# Altium schematic sheet MGMEZZ02.SchDoc: Top Level
size Letter; Author: Adam Gilbert; CompanyName: McGill University; DrawnBy: Adam Gilbert; Organization: Altium Limited; Address1: McGill Cosmology; Address2: 3600 University Street; Address3: Montreal, Quebec; Address4: Canada; Revision: Rev0; ProjectTitle: Dan DfMux Mezz; ModelNumber: MGMEZZ02; DocumentName: Top Level; ProjectName: Dan DfMux Mezz
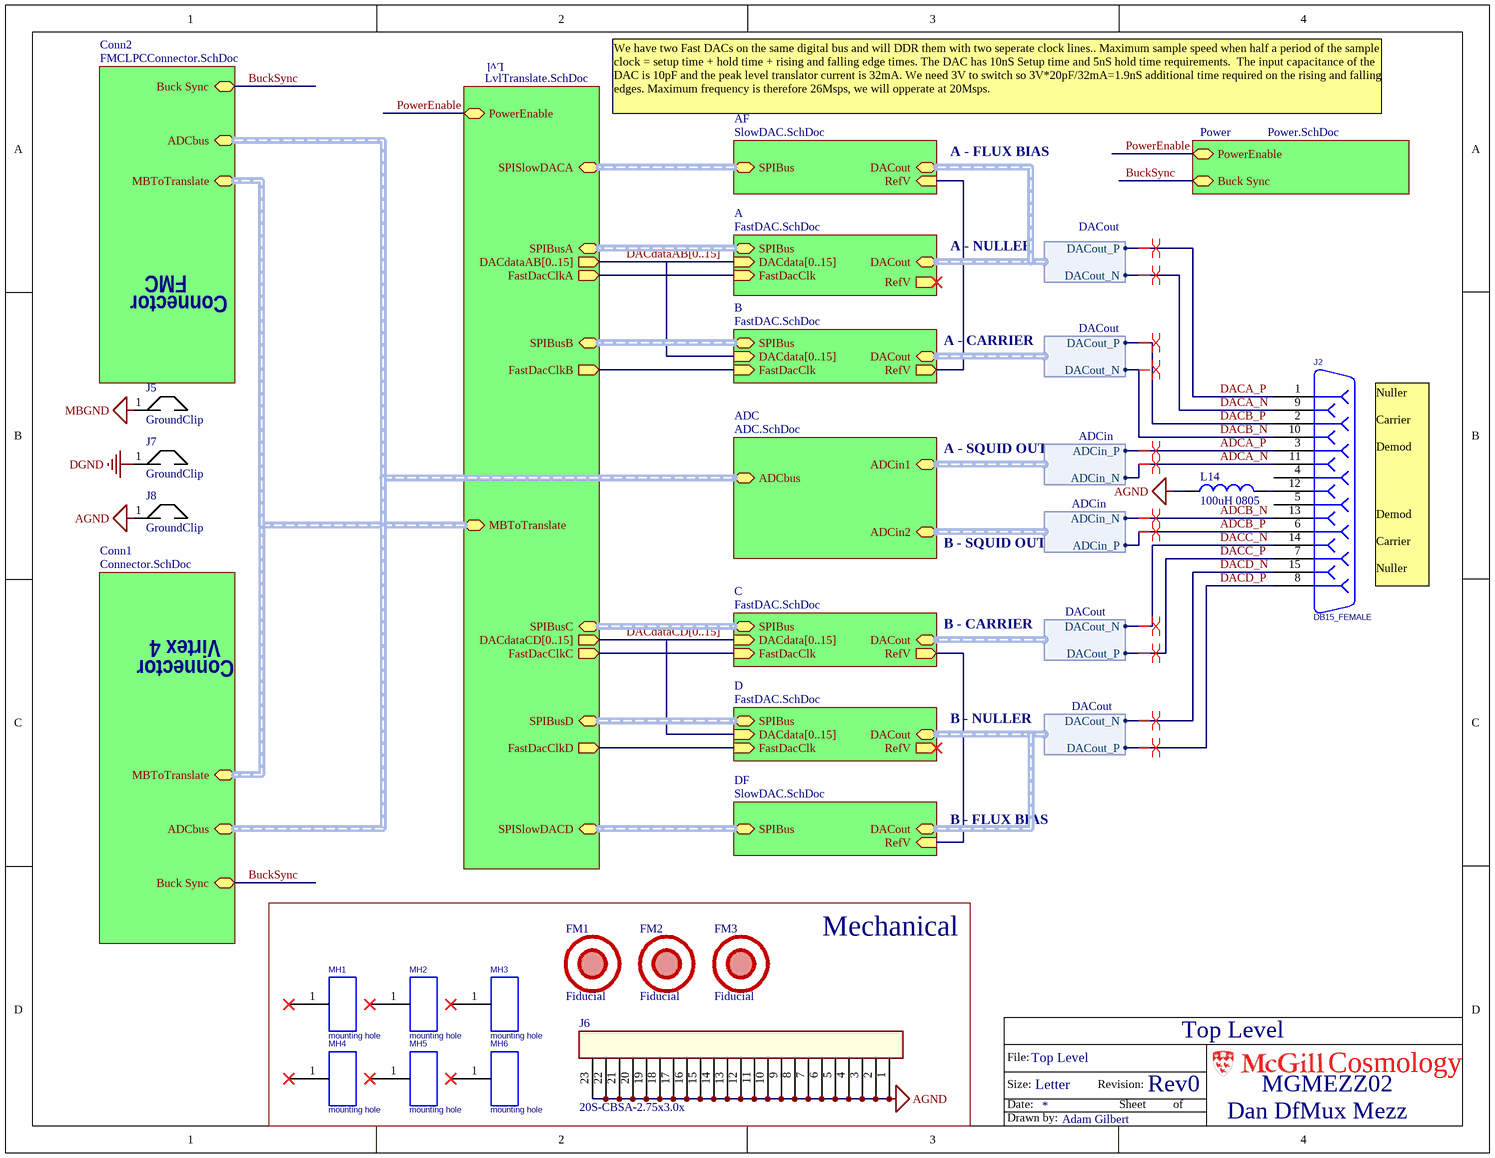
[diagram p0: MGMEZZ02.SchDoc]

## Parts
FM1  Fiducial  [Fiducial_mark]  (no BOM)
FM2  Fiducial  [Fiducial_mark]  (no BOM)
FM3  Fiducial  [Fiducial_mark]  (no BOM)
J2  DB15_FEMALE  [DSUB/RS.318/TM/15]
J5  GroundClip  [GroundClip]
J6  20S-CBSA-2.75x3.0x  [SHIELD 2.75X3.00]
J7  GroundClip  [GroundClip]
J8  GroundClip  [GroundClip]
L14  100uH 0805  [0805]
MH1  mounting hole  [MTHOLE.125]  (no BOM)
MH2  mounting hole  [MTHOLE.125]  (no BOM)
MH3  mounting hole  [MTHOLE.125]  (no BOM)
MH4  mounting hole  [MTHOLE.125]  (no BOM)
MH5  mounting hole  [MTHOLE.125]  (no BOM)
MH6  mounting hole  [MTHOLE.125]  (no BOM)

## Blocks framed on the sheet
Mechanical: FM1-FM3 J6 MH1-MH6

## Sub-sheets
A = FastDAC.SchDoc: DACout (harness DACout), SPIBus (harness SPIBus), FastDacClk (in), DACdata[0..15] (in), RefV (out)
ADC = ADC.SchDoc: ADCbus (harness ADCbus), ADCin1 (harness ADCin), ADCin2 (harness ADCin)
AF = SlowDAC.SchDoc: DACout (harness DACout), SPIBus (harness SPIBus), RefV (in)
B = FastDAC.SchDoc: DACout (harness DACout), SPIBus (harness SPIBus), FastDacClk (in), DACdata[0..15] (in), RefV (out)
C = FastDAC.SchDoc: DACout (harness DACout), SPIBus (harness SPIBus), FastDacClk (in), DACdata[0..15] (in), RefV (out)
Conn1 = Connector.SchDoc: ADCbus (harness ADCbus), MBToTranslate (harness MBToTranslate), Buck Sync
Conn2 = FMCLPCConnector.SchDoc: MBToTranslate (harness MBToTranslate), ADCbus (harness SlowDACin), Buck Sync
D = FastDAC.SchDoc: DACout (harness DACout), SPIBus (harness SPIBus), FastDacClk (in), DACdata[0..15] (in), RefV (out)
DF = SlowDAC.SchDoc: DACout (harness DACout), SPIBus (harness SPIBus), RefV (in)
Lvl = LvlTranslate.SchDoc: MBToTranslate (harness MBToTranslate), PowerEnable, SPISlowDACA (harness SPIBus), SPISlowDACD (harness SPIBus), SPIBusA (harness SPIBus), SPIBusB (harness SPIBus), SPIBusC (harness SPIBus), SPIBusD (harness SPIBus), DACdataAB[0..15] (out), FastDacClkA (out), FastDacClkB (out), DACdataCD[0..15] (out), FastDacClkC (out), FastDacClkD (out)
Power = Power.SchDoc: PowerEnable, Buck Sync

## Harnesses
ADCin: ADCin_P, ADCin_N
DACout: DACout_P, DACout_N

## Nets
AGND: J6.1 J6.2 J6.3 J6.4 J6.5 J6.6 J6.7 J6.8 J6.9 J6.10 J6.11 J6.12 J6.13 J6.14 J6.15 J6.16 J6.17 J6.18 J6.19 J6.20 J6.21 J6.22 J6.23 J8.1 L14.1
DGND: J7.1
MBGND: J5.1
ADCA_N: J2.11(p11) ; sheet ADC/ADCin1.ADCin_N
ADCA_P: J2.3(p3) ; sheet ADC/ADCin1.ADCin_P
ADCB_N: J2.13(p13) ; sheet ADC/ADCin2.ADCin_N
ADCB_P: J2.6(p6) ; sheet ADC/ADCin2.ADCin_P
BuckSync: sheet Power/Buck Sync, sheet Conn1/Buck Sync, sheet Conn2/Buck Sync
DACA_N: J2.9(p9) ; sheet A/DACout.DACout_N
DACA_P: J2.1(p1) ; sheet A/DACout.DACout_P
DACB_N: J2.10(p10) ; sheet B/DACout.DACout_N
DACB_P: J2.2(p2) ; sheet B/DACout.DACout_P
DACC_N: J2.14(p14) ; sheet C/DACout.DACout_N
DACC_P: J2.7(p7) ; sheet C/DACout.DACout_P
DACD_N: J2.15(p15) ; sheet DF/DACout.DACout_N
DACD_P: J2.8(p8) ; sheet DF/DACout.DACout_P
PowerEnable: sheet Power/PowerEnable, sheet Lvl/PowerEnable
NetJ2_12: J2.12(p12) L14.2
(unnamed): sheet A/FastDacClk, sheet Lvl/FastDacClkA
(unnamed): sheet Lvl/FastDacClkB, sheet B/FastDacClk
(unnamed): sheet Lvl/FastDacClkC, sheet C/FastDacClk
(unnamed): sheet Lvl/FastDacClkD, sheet D/FastDacClk
(unnamed): sheet AF/RefV, sheet B/RefV
(unnamed): sheet DF/RefV, sheet C/RefV

Not connected (* = marked no-connect by the designer): J2 4(p4) 5(p5); MH1 1(A)*; MH2 1(A)*; MH3 1(A)*; MH4 1(A)*; MH5 1(A)*; MH6 1(A)*

## Buses and harness runs
bus DACdataAB[0..15] = sheet A/DACdata[0..15] = sheet B/DACdata[0..15] = sheet Lvl/DACdataAB[0..15]
bus DACdataCD[0..15] = sheet C/DACdata[0..15] = sheet D/DACdata[0..15] = sheet Lvl/DACdataCD[0..15]
harness sheet A/DACout = sheet AF/DACout
harness sheet A/SPIBus = sheet Lvl/SPIBusA
harness sheet ADC/ADCbus = sheet Conn1/ADCbus = sheet Conn2/ADCbus
harness sheet AF/SPIBus = sheet Lvl/SPISlowDACA
harness sheet B/SPIBus = sheet Lvl/SPIBusB
harness sheet C/SPIBus = sheet Lvl/SPIBusC
harness sheet Conn1/MBToTranslate = sheet Conn2/MBToTranslate = sheet Lvl/MBToTranslate
harness sheet D/DACout = sheet DF/DACout
harness sheet D/SPIBus = sheet Lvl/SPIBusD
harness sheet DF/SPIBus = sheet Lvl/SPISlowDACD

## Layout directives
differential pair: ADCA_N, ADCA_P, ADCB_N, ADCB_P, DACA_N, DACA_P, DACB_N, DACB_P, DACC_N, DACC_P, DACD_N, DACD_P

## Notes on the sheet
- We have two Fast DACs on the same digital bus and will DDR them with two seperate clock lines.. Maximum sample speed when half a period of the sample clock = setup time + hold time + rising and falling edge times. The DAC has 10nS Setup time and 5nS hold time requirements.  The input capacitance of the DAC is 10pF and the peak level translator current is 32mA. We need 3V to switch so 3V*20pF/32mA=1.9nS additional time required on the rising and falling edges. Maximum frequency is therefore 26Msps, we will opperate at 20Msps.
- A - FLUX BIAS
- FMC
- Connector
- A - NULLER
- A - CARRIER
- A - SQUID OUT
- B - SQUID OUT
- Virtex 4
- B - CARRIER
- Nuller
  Carrier
  Demod
  Demod
  Carrier
  Nuller
- B - NULLER
- B - FLUX BIAS
- File:
- Size:
- Date:
- Letter
- Revision:
- Sheet
- of
- Cosmology
- Drawn by:

## Library data of the parts
FM1-FM3 = Fiducial: Assembly Comments: none; Type: Fiducial; SupplierUnitCost: 0
J2 = DB15_FEMALE: Part Constraints: 182-015-213R181; Manufacturer: Norcomp; Assembly Comments: none; Manufacturers Part Number: 182-015-213R181; Supplier 1: Digi-Key; Supplier Part Number 1: 182-815FE-ND
J5 J7 J8 = GroundClip: Ground Clip point; Manufacturer: Keystone Electronics; Part Constraints: 5015; Assembly Comments: none; SupplierUnitCost: $0.53; Type: Ground clip point; Supplier 1: Digi-Key; Supplier Part Number 1: 5015KCT-ND; Manufacturers Part Number: 5015
J6 = MezzShield
L14 = IND 0805: Inductor 0805; Manufacturer: TDK Corporation; Manufacturers Part Number: GLCR2012T101M-HC; Part Constraints: 100uH, 4.5Ohms DRC, Irms 40mA; Assembly Comments: none; Type: Inductor; SupplierUnitCost: $0.33; Value: 100uH 0805
MH1-MH6 = MTHOLE